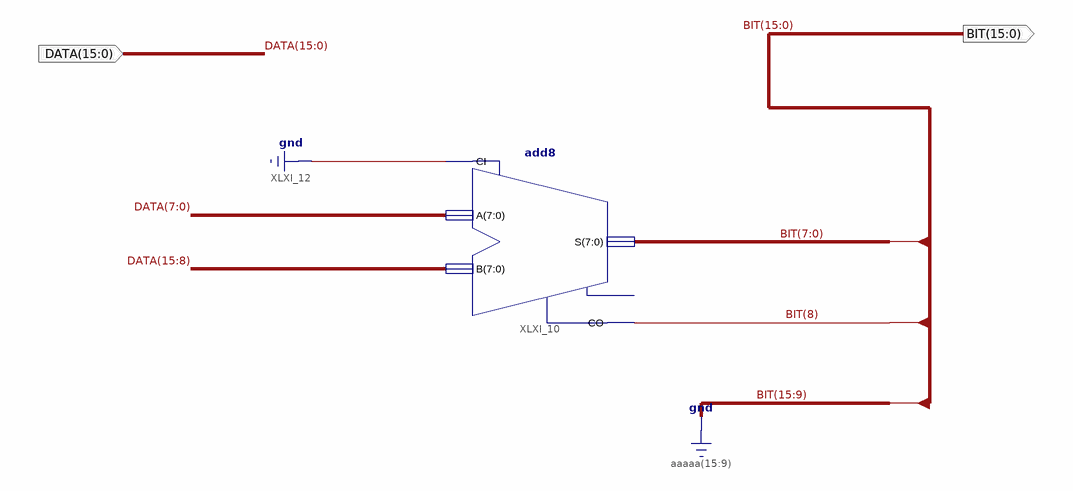
[diagram p0: schematic sheet 1]
// Xilinx ISE schematic Full_adder.sch (spartan6) as structural Verilog: 1 symbols, 2 ports
module Full_adder (
  input  [15:0] DATA,
  output [15:0] BIT
);

  add8 XLXI_10 (.A(DATA[7:0]), .B(DATA[15:8]), .CI(1'b0), .CO(BIT[8]), .S(BIT[7:0]));  // open: OFL

  assign BIT[15:9] = {7{1'b0}};
endmodule
